# Altium schematic sheet pc104-template.SchDoc
size 297 x 209 mm
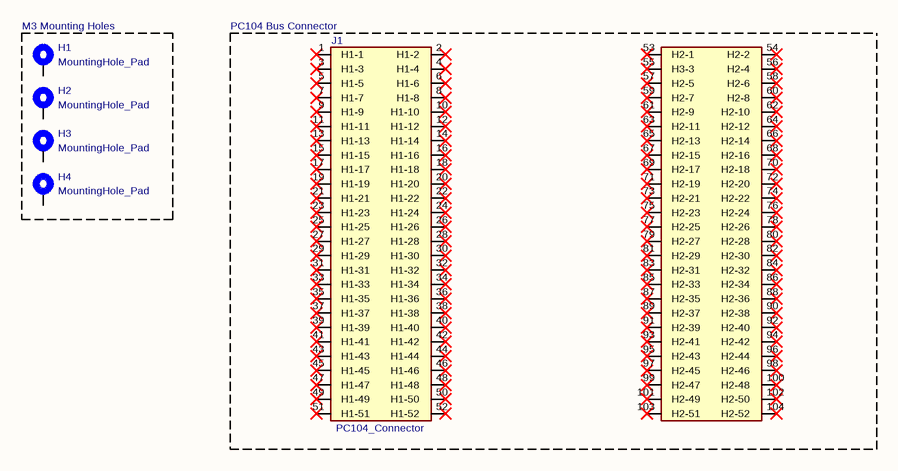
[diagram p0: pc104-template.SchDoc]

## Parts
H1  MountingHole_Pad  [MountingHole_3.2mm_M3_Pad_TopBottom]
H2  MountingHole_Pad  [MountingHole_3.2mm_M3_Pad_TopBottom]
H3  MountingHole_Pad  [MountingHole_3.2mm_M3_Pad_TopBottom]
H4  MountingHole_Pad  [MountingHole_3.2mm_M3_Pad_TopBottom]
J1  PC104_Connector  [pc104-connector]

## Blocks framed on the sheet
M3 Mounting Holes /: H1-H4
PC104 Bus Connector: J1

## Nets

Not connected (* = marked no-connect by the designer): H1 1; H2 1; H3 1; H4 1; J1 1(H1-1)* 2(H1-2)* 3(H1-3)* 4(H1-4)* 5(H1-5)* 6(H1-6)* 7(H1-7)* 8(H1-8)* 9(H1-9)* 10(H1-10)* 11(H1-11)* 12(H1-12)* 13(H1-13)* 14(H1-14)* 15(H1-15)* 16(H1-16)* 17(H1-17)* 18(H1-18)* 19(H1-19)* 20(H1-20)* 21(H1-21)* 22(H1-22)* 23(H1-23)* 24(H1-24)* 25(H1-25)* 26(H1-26)* 27(H1-27)* 28(H1-28)* 29(H1-29)* 30(H1-30)* 31(H1-31)* 32(H1-32)* 33(H1-33)* 34(H1-34)* 35(H1-35)* 36(H1-36)* 37(H1-37)* 38(H1-38)* 39(H1-39)* 40(H1-40)* 41(H1-41)* 42(H1-42)* 43(H1-43)* 44(H1-44)* 45(H1-45)* 46(H1-46)* 47(H1-47)* 48(H1-48)* 49(H1-49)* 50(H1-50)* 51(H1-51)* 52(H1-52)* 53(H2-1)* 54(H2-2)* 55(H3-3)* 56(H2-4)* 57(H2-5)* 58(H2-6)* 59(H2-7)* 60(H2-8)* 61(H2-9)* 62(H2-10)* 63(H2-11)* 64(H2-12)* 65(H2-13)* 66(H2-14)* 67(H2-15)* 68(H2-16)* 69(H2-17)* 70(H2-18)* 71(H2-19)* 72(H2-20)* 73(H2-21)* 74(H2-22)* 75(H2-23)* 76(H2-24)* 77(H2-25)* 78(H2-26)* 79(H2-27)* 80(H2-28)* 81(H2-29)* 82(H2-30)* 83(H2-31)* 84(H2-32)* 85(H2-33)* 86(H2-34)* 87(H2-35)* 88(H2-36)* 89(H2-37)* 90(H2-38)* 91(H2-39)* 92(H2-40)* 93(H2-41)* 94(H2-42)* 95(H2-43)* 96(H2-44)* 97(H2-45)* 98(H2-46)* 99(H2-47)* 100(H2-48)* 101(H2-49)* 102(H2-50)* 103(H2-51)* 104(H2-52)*

## Notes on the sheet
- 1
- 2
- 3
- 4
- 5
- 6
- A
- B
- C
- D
- Title:
- File: pc104-template.kicad_sch
- Sheet: /
- KiCad E.D.A.  kicad (5.1.4)-1
- Size: A4
- Date:
- Rev:
- Id: 1/1

## Library data of the parts
H1-H4 = MountingHole_Pad: Value: MountingHole_Pad; Footprint: MountingHole:MountingHole_3.2mm_M3_Pad_TopBottom
J1 = PC104_Connector: Value: PC104_Connector; Footprint: pc104-template:pc104-connector